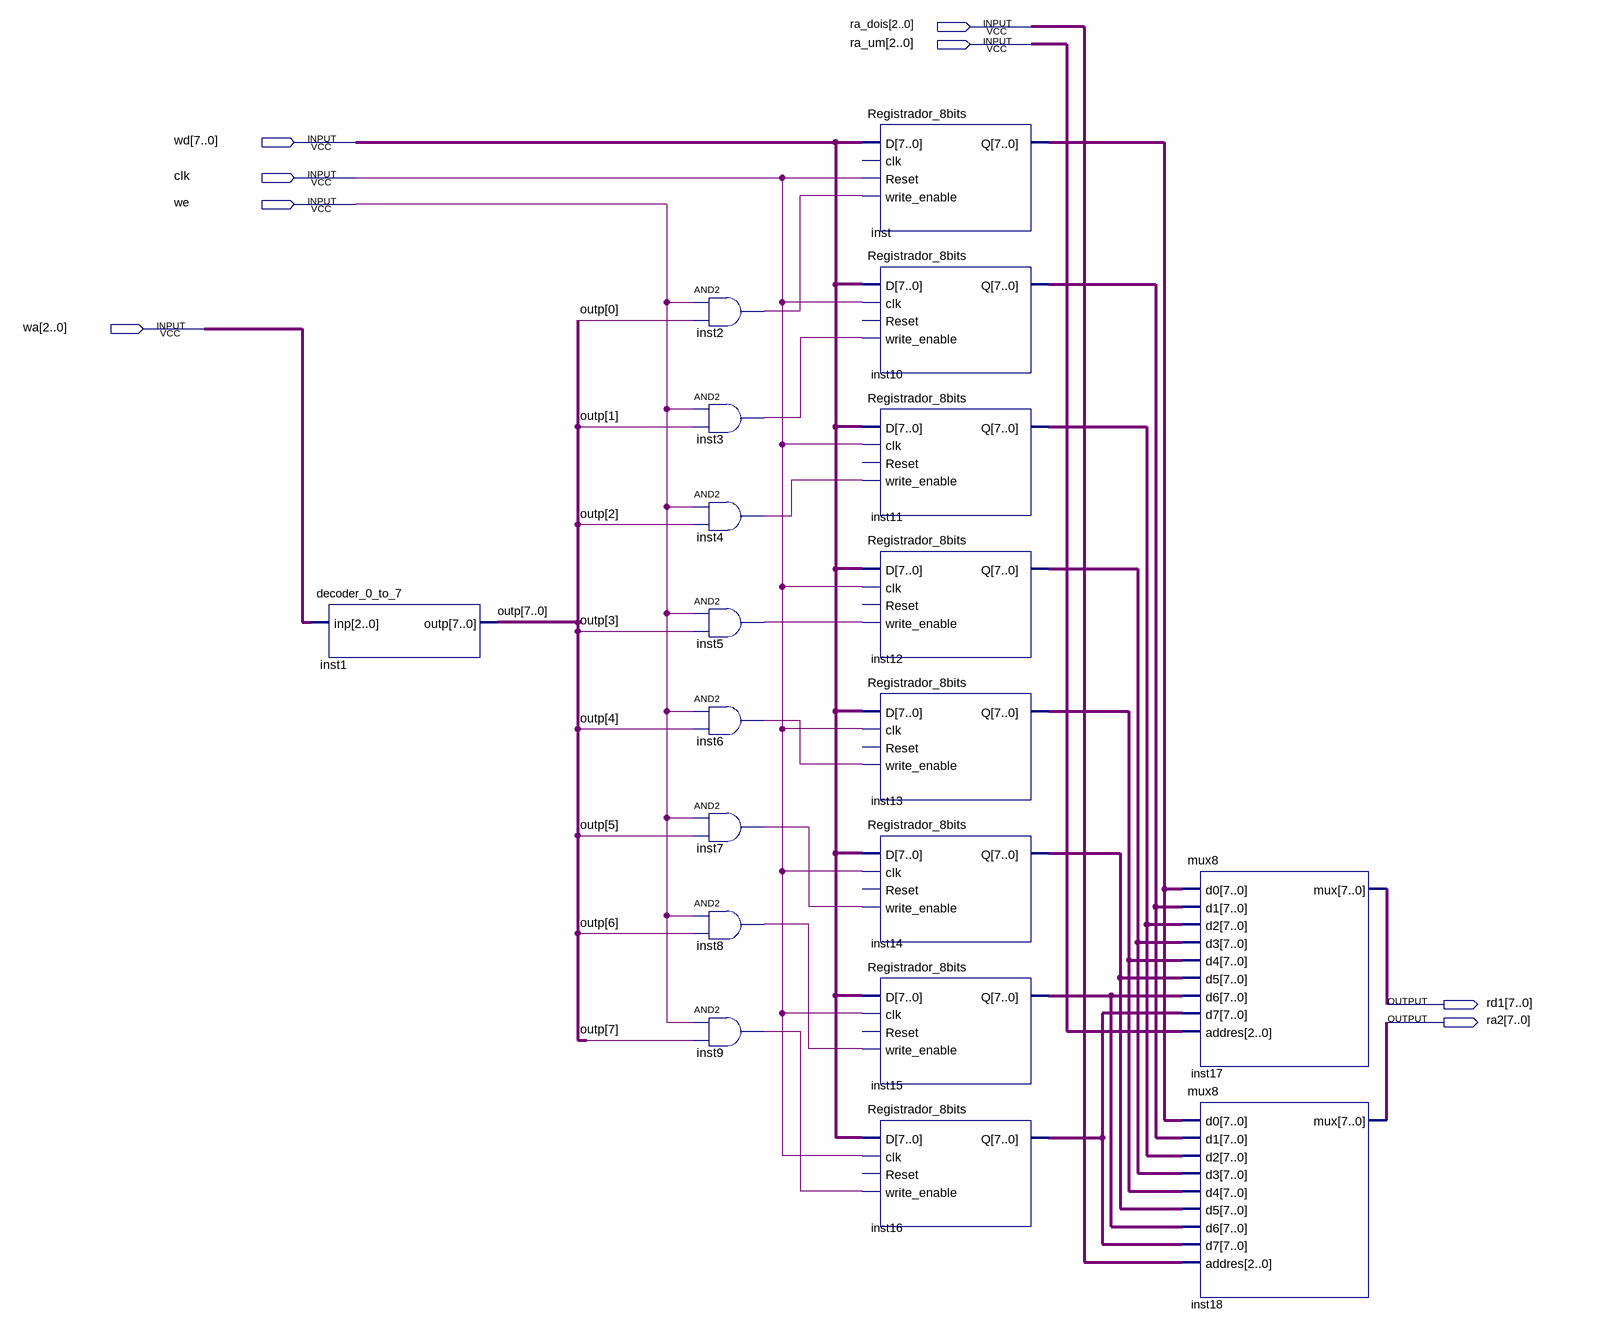
[diagram p0: schematic sheet]
// Quartus schematic Banco_de_Registradores.bdf as structural Verilog: 19 symbols, 8 pins
module Banco_de_Registradores (
  input  [2:0] ra_dois,
  input  [2:0] ra_um,
  input  [7:0] wd,
  input  clk,
  input  we,
  input  [2:0] wa,
  output [7:0] rd1,
  output [7:0] ra2
);

  wire inst2_out, inst3_out, inst4_out, inst5_out, inst6_out, inst7_out, inst8_out, inst9_out;
  wire [7:0] inst10_q, inst11_q, inst12_q, inst13_q, inst14_q, inst15_q, inst16_q, inst_q, outp;

  decoder_0_to_7 inst1 (.inp(wa), .outp(outp));
  and inst2 (inst2_out, we, outp[0]);
  and inst3 (inst3_out, we, outp[1]);
  and inst4 (inst4_out, we, outp[2]);
  and inst5 (inst5_out, we, outp[3]);
  and inst6 (inst6_out, we, outp[4]);
  and inst7 (inst7_out, we, outp[5]);
  and inst8 (inst8_out, we, outp[6]);
  and inst9 (inst9_out, we, outp[7]);
  Registrador_8bits inst (.D(wd), .Reset(clk), .write_enable(inst2_out), .Q(inst_q));  // open: clk
  Registrador_8bits inst10 (.D(wd), .clk(clk), .write_enable(inst3_out), .Q(inst10_q));  // open: Reset
  Registrador_8bits inst11 (.D(wd), .clk(clk), .write_enable(inst4_out), .Q(inst11_q));  // open: Reset
  Registrador_8bits inst12 (.D(wd), .clk(clk), .write_enable(inst5_out), .Q(inst12_q));  // open: Reset
  Registrador_8bits inst13 (.D(wd), .clk(clk), .write_enable(inst6_out), .Q(inst13_q));  // open: Reset
  Registrador_8bits inst14 (.D(wd), .clk(clk), .write_enable(inst7_out), .Q(inst14_q));  // open: Reset
  Registrador_8bits inst15 (.D(wd), .clk(clk), .write_enable(inst8_out), .Q(inst15_q));  // open: Reset
  Registrador_8bits inst16 (.D(wd), .clk(clk), .write_enable(inst9_out), .Q(inst16_q));  // open: Reset
  mux8 inst17 (
    .d0(inst_q), .d1(inst10_q), .d2(inst11_q), .d3(inst12_q), .d4(inst13_q), .d5(inst14_q), .d6(inst15_q),
    .d7(inst16_q), .addres(ra_um), .mux(rd1));
  mux8 inst18 (
    .d0(inst_q), .d1(inst10_q), .d2(inst11_q), .d3(inst12_q), .d4(inst13_q), .d5(inst14_q), .d6(inst15_q),
    .d7(inst16_q), .addres(ra_dois), .mux(ra2));
endmodule
